# EAGLE schematic md (EAGLE 9.6.2)
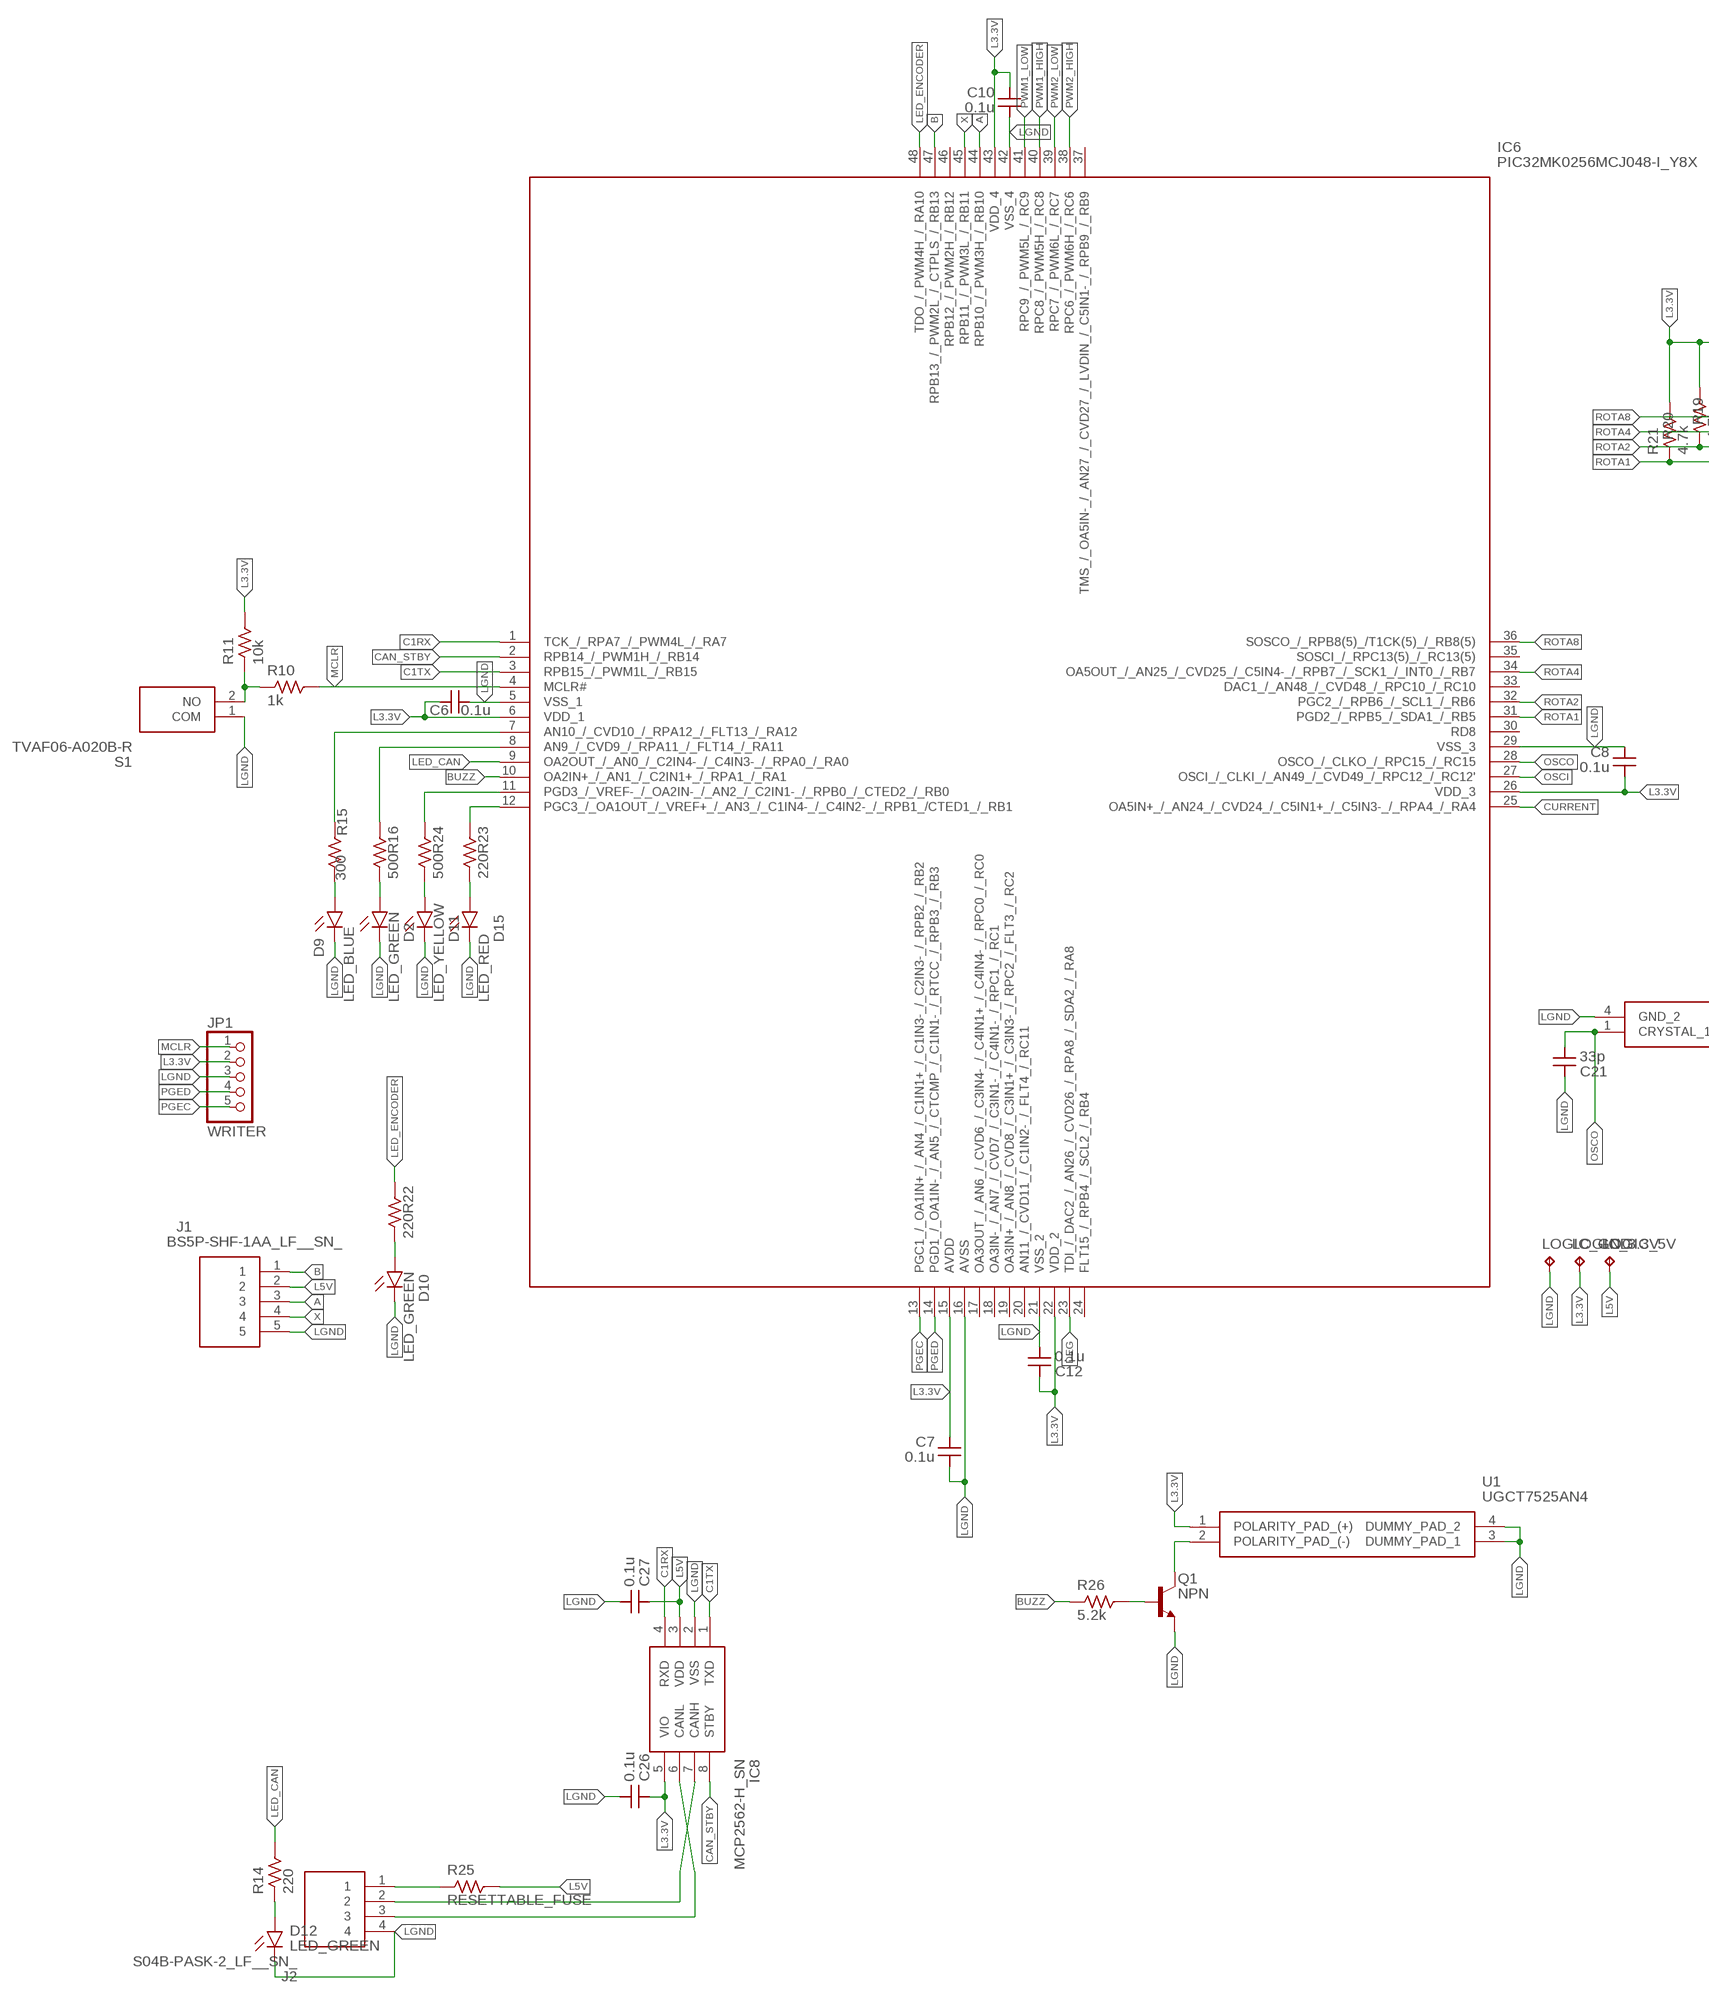
[diagram p0: schematic, sheet 1, part 1 of 2]
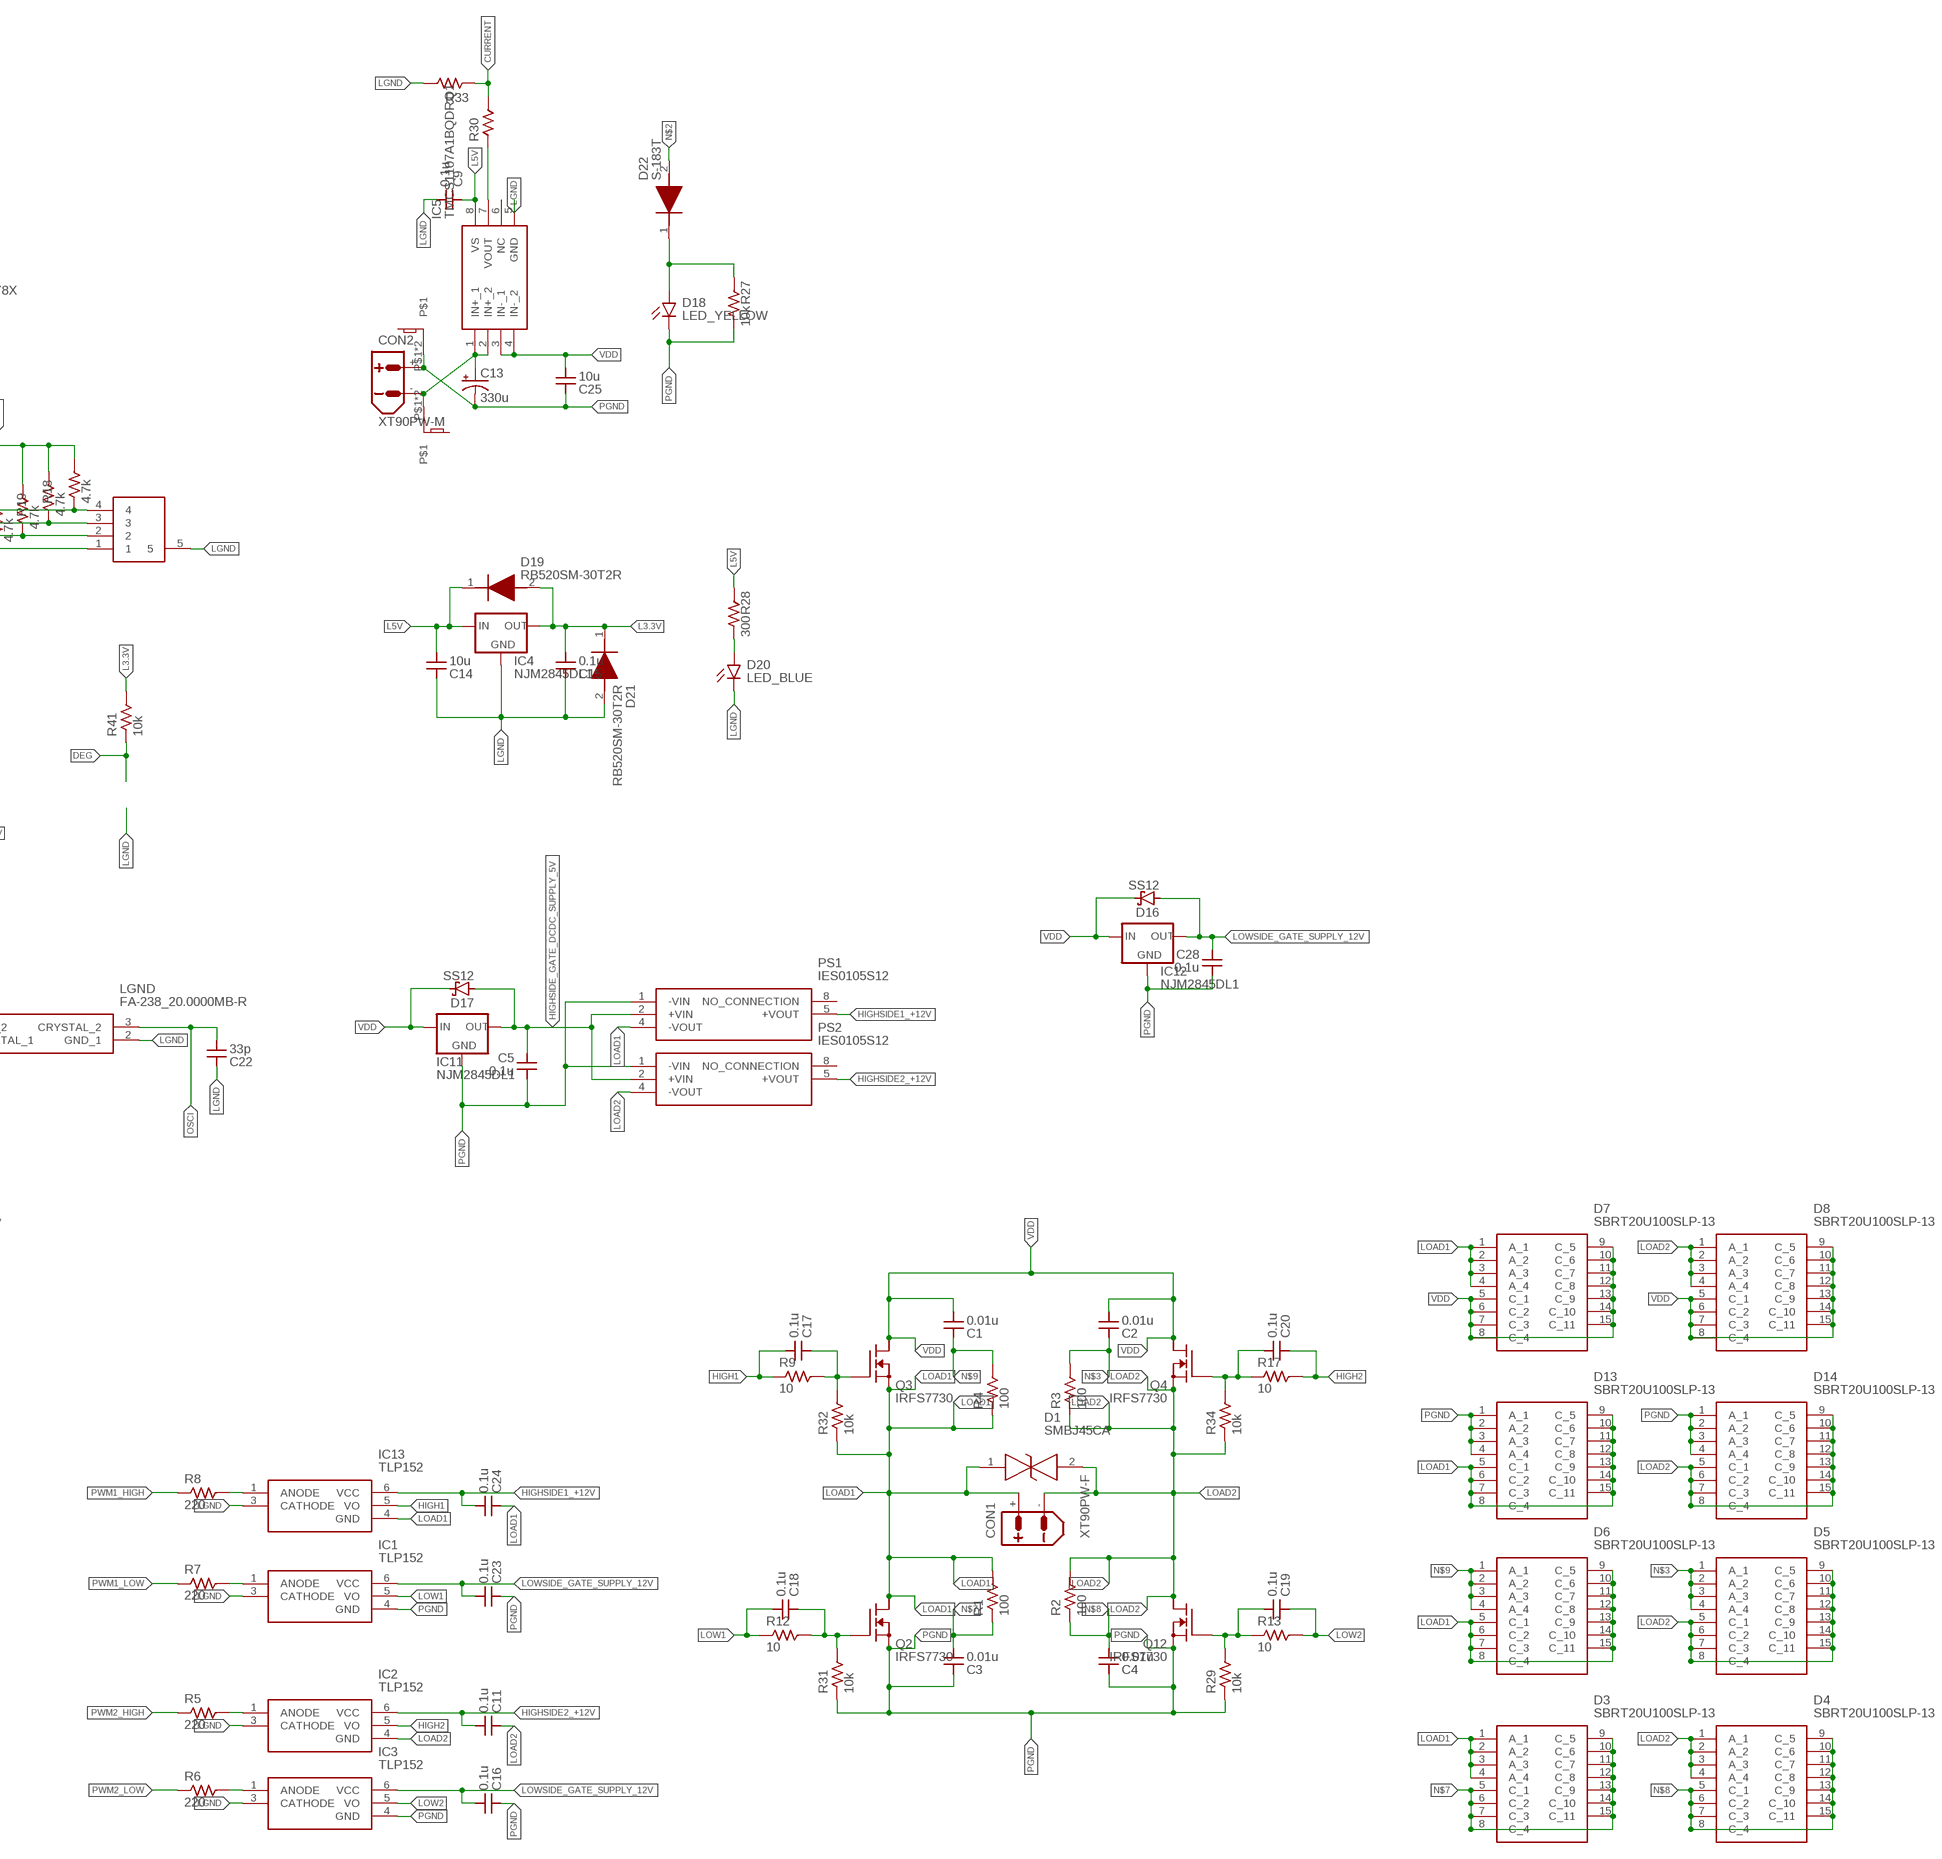
[diagram p1: schematic, sheet 1, part 2 of 2]

## Parts
C1  0.01u  CC3216  [C3216]
C2  0.01u  CC3216  [C3216]
C3  0.01u  CC3216  [C3216]
C4  0.01u  CC3216  [C3216]
C5  0.1u  CC1068  [C1608]
C6  0.1u  CC1068  [C1608]
C7  0.1u  CC1068  [C1608]
C8  0.1u  CC1068  [C1608]
C9  0.1u  CC1068  [C1608]
C10  0.1u  CC1068  [C1608]
C11  0.1u  CC1068  [C1608]
C12  0.1u  CC1068  [C1608]
C13  330u  C-POL-US_ECAP-8.5MM  [CAPAE830X1050N]
C14  10u  CC1068  [C1608]
C15  0.1u  CC1068  [C1608]
C16  0.1u  CC1068  [C1608]
C17  0.1u  CC1068  [C1608]
C18  0.1u  CC1068  [C1608]
C19  0.1u  CC1068  [C1608]
C20  0.1u  CC1068  [C1608]
C21  33p  CC1068  [C1608]
C22  33p  CC1068  [C1608]
C23  0.1u  CC1068  [C1608]
C24  0.1u  CC1068  [C1608]
C25  10u  CC3216  [C3216]
C26  0.1u  CC1068  [C1608]
C27  0.1u  CC1068  [C1608]
C28  0.1u  CC1068  [C1608]
CON1  XT90PW-F  [XT90PW-F]
CON2  XT90PW-M  [XT90PW-M]
D1  SMBJ45CA  [DIOM5336X265N]
D2  LED_GREEN  CHIP-FLAT-G_0603-0.55MM  [LEDC1608X55N_FLAT-G]
D3  SBRT20U100SLP-13  [SBRT20U100SLP13]
D4  SBRT20U100SLP-13  [SBRT20U100SLP13]
D5  SBRT20U100SLP-13  [SBRT20U100SLP13]
D6  SBRT20U100SLP-13  [SBRT20U100SLP13]
D7  SBRT20U100SLP-13  [SBRT20U100SLP13]
D8  SBRT20U100SLP-13  [SBRT20U100SLP13]
D9  LED_BLUE  CHIP-FLAT-B_0603-0.55MM  [LEDC1608X55N_FLAT-B]
D10  LED_GREEN  CHIP-FLAT-G_0603-0.55MM  [LEDC1608X55N_FLAT-G]
D11  LED_YELLOW  CHIP-FLAT-Y_0603-0.55MM  [LEDC1608X55N_FLAT-Y]
D12  LED_GREEN  CHIP-FLAT-G_0603-0.55MM  [LEDC1608X55N_FLAT-G]
D13  SBRT20U100SLP-13  [SBRT20U100SLP13]
D14  SBRT20U100SLP-13  [SBRT20U100SLP13]
D15  LED_RED  CHIP-FLAT-R_0603-0.55MM  [LEDC1608X55N_FLAT-R]
D16  SS12  [SMA]
D17  SS12  [SMA]
D18  LED_YELLOW  CHIP-FLAT-Y_0603-0.55MM  [LEDC1608X55N_FLAT-Y]
D19  RB520SM-30T2R  [DIOC1608X70N]
D20  LED_BLUE  CHIP-FLAT-B_0603-0.55MM  [LEDC1608X55N_FLAT-B]
D21  RB520SM-30T2R  [DIOC1608X70N]
D22  S-183T  [SODFL3516X70N]
IC1  TLP152  [11-4L1S(5-PIN-SOIC)]
IC2  TLP152  [11-4L1S(5-PIN-SOIC)]
IC3  TLP152  [11-4L1S(5-PIN-SOIC)]
IC4  NJM2845DL1  [TO252]
IC5  TMCS1107A1BQDRQ1  [SOIC127P600X175-8N]
IC6  PIC32MK0256MCJ048-I_Y8X  [QFP50P900X900X120-48N]
IC8  MCP2562-H_SN  [SOIC127P600X175-8N]
IC11  NJM2845DL1  [TO252]
IC12  NJM2845DL1  [TO252]
IC13  TLP152  [11-4L1S(5-PIN-SOIC)]
J1  BS5P-SHF-1AA_LF__SN_  [HDRRA5W64P0X250_1X5_1250X600X5]
J2  S04B-PASK-2_LF__SN_  [S04BPASK2LFSN]
JP1  WRITER  PINHD-1X5/90  [1X05/90]
LGND  FA-238_20.0000MB-R  [FA238200000MBR]
LOGIC_3.3V  TPPAD1-13  [P1-13]
LOGIC_5V  TPPAD1-13  [P1-13]
LOGIC_GND  TPPAD1-13  [P1-13]
PS1  IES0105S12  [IES0105S12]
PS2  IES0105S12  [IES0105S12]
Q1  NPN  NPN_SC59-BEC  [SC59]
Q2  IRFS7730  [D2PAK-7]
Q3  IRFS7730  [D2PAK-7]
Q4  IRFS7730  [D2PAK-7]
Q12  IRFS7730  [D2PAK-7]
R1  100  R2W  [C2512]
R2  100  R2W  [C2512]
R3  100  R2W  [C2512]
R4  100  R2W  [C2512]
R5  220  R1/10W  [C1608]
R6  220  R1/10W  [C1608]
R7  220  R1/10W  [C1608]
R8  220  R1/10W  [C1608]
R9  10  R3/4W  [2010]
R10  1k  R1/10W  [C1608]
R11  10k  R1/10W  [C1608]
R12  10  R3/4W  [2010]
R13  10  R3/4W  [2010]
R14  220  R1/10W  [C1608]
R15  300  R1/10W  [C1608]
R16  500  R1/10W  [C1608]
R17  10  R3/4W  [2010]
R18  4.7k  R1/10W  [C1608]
R19  4.7k  R1/10W  [C1608]
R20  4.7k  R1/10W  [C1608]
R21  4.7k  R1/10W  [C1608]
R22  220  R1/10W  [C1608]
R23  220  R1/10W  [C1608]
R24  500  R1/10W  [C1608]
R25  RESETTABLE_FUSE  R3216(1206)  [C3216]
R26  5.2k  R1/10W  [C1608]
R27  10k  R1/10W  [C1608]
R28  300  R1/10W  [C1608]
R29  10k  R1/10W  [C1608]
R30  R1/10W  [C1608]
R31  10k  R1/10W  [C1608]
R32  10k  R1/10W  [C1608]
R33  R1/10W  [C1608]
R34  10k  R1/10W  [C1608]
R41  10k  R1/10W  [C1608]
S1  TVAF06-A020B-R  [TVAF06A020BR]
S2  DRR4016  [DRR4016]
SCREW1  KIBANNNEZI  [ＰＣＢ－５４Ｌ（Ｍ３）]
SCREW2  KIBANNNEZI  [ＰＣＢ－５４Ｌ（Ｍ３）]
U1  UGCT7525AN4  [UGCT7525AN4]

## Nets
A: IC6.44(RPB10_/_PWM3H_/_RB10) J1.3
B: IC6.47(RPB13_/_PWM2L_/_CTPLS_/_RB13) J1.1
BUZZ: IC6.10(OA2IN+_/_AN1_/_C2IN1+_/_RPA1_/_RA1) R26.1
C1RX: IC6.1(TCK_/_RPA7_/_PWM4L_/_RA7) IC8.4(RXD)
C1TX: IC6.3(RPB15_/_PWM1L_/_RB15) IC8.1(TXD)
CAN_STBY: IC6.2(RPB14_/_PWM1H_/_RB14) IC8.8(STBY)
CURRENT: IC6.25(OA5IN+_/_AN24_/_CVD24_/_C5IN1+_/_C5IN3-_/_RPA4_/_RA4) R30.2 R33.1
DEG: IC6.23(TDI_/_DAC2_/_AN26_/_CVD26_/_RPA8_/_SDA2_/_RA8) R41.1
H1GATE: C17.2 Q3.G(Nｃｈ-G) R9.P$2 R32.2
H2GATE: C20.1 Q4.G(Nｃｈ-G) R17.P$1 R34.2
HIGH1: C17.1 IC13.5(VO) R9.P$1
HIGH2: C20.2 IC2.5(VO) R17.P$2
HIGHSIDE1_+12V: C24.1 IC13.6(VCC) PS1.5(+VOUT)
HIGHSIDE2_+12V: C11.1 IC2.6(VCC) PS2.5(+VOUT)
HIGHSIDE_GATE_DCDC_SUPPLY_5V: C5.2 D17.A IC11.3(OUT) PS1.2(+VIN) PS2.2(+VIN)
IN1: IC8.7(CANH) J2.2
IN2: IC8.6(CANL) J2.3
L1GATE: C18.2 Q2.G(Nｃｈ-G) R12.P$2 R31.2
L2GATE: C19.1 Q12.G(Nｃｈ-G) R13.P$1 R29.2
L3.3V: C6.2 C7.2 C8.1 C10.2 C12.2 C15.1 C26.2 D19.2(A) D21.1(K) IC4.3(OUT) IC6.6(VDD_1) IC6.15(AVDD) IC6.22(VDD_2) IC6.26(VDD_3) IC6.43(VDD_4) IC8.5(VIO) JP1.2 LOGIC_3.3V.TP R11.2 R18.2 R19.2 R20.2 R21.2 R41.2 U1.1(POLARITY_PAD_(+))
L5V: C9.2 C14.1 C27.2 D19.1(K) IC4.1(IN) IC5.8(VS) IC8.3(VDD) J1.2 LOGIC_5V.TP R25.2 R28.2
LED_CAN: IC6.9(OA2OUT_/_AN0_/_C2IN4-_/_C4IN3-_/_RPA0_/_RA0) R14.2
LED_ENCODER: IC6.48(TDO_/_PWM4H_/_RA10) R22.2
LGND: C6.1 C7.1 C8.2 C9.1 C10.1 C12.1 C14.2 C15.2 C21.2 C22.2 C26.1 C27.1 D2.C D9.C D10.C D11.C D12.C D15.C D20.C D21.2(A) IC1.3(CATHODE) IC2.3(CATHODE) IC3.3(CATHODE) IC4.2(GND) IC5.5(GND) IC6.5(VSS_1) IC6.16(AVSS) IC6.21(VSS_2) IC6.29(VSS_3) IC6.42(VSS_4) IC8.2(VSS) IC13.3(CATHODE) J1.5 J2.4 JP1.3 LGND.2(GND_1) LGND.4(GND_2) LOGIC_GND.TP Q1.E R33.2 S1.1(COM) S2.5 U1.3(DUMMY_PAD_1) U1.4(DUMMY_PAD_2)
LOAD1: C24.2 CON1.+ D1.1 D3.1(A_1) D3.2(A_2) D3.3(A_3) D3.4(A_4) D6.5(C_1) D6.6(C_2) D6.7(C_3) D6.8(C_4) D6.9(C_5) D6.10(C_6) D6.11(C_7) D6.12(C_8) D6.13(C_9) D6.14(C_10) D6.15(C_11) D7.1(A_1) D7.2(A_2) D7.3(A_3) D7.4(A_4) D13.5(C_1) D13.6(C_2) D13.7(C_3) D13.8(C_4) D13.9(C_5) D13.10(C_6) D13.11(C_7) D13.12(C_8) D13.13(C_9) D13.14(C_10) D13.15(C_11) IC13.4(GND) PS1.4(-VOUT) Q2.D(NｃｈD) Q3.S1(NｃｈS) Q3.S2(NｃｈS) Q3.S3(NｃｈS) Q3.S4(NｃｈS) Q3.S5(NｃｈS) R1.2 R4.1 R32.1
LOAD2: C11.2 CON1.- D1.2 D4.1(A_1) D4.2(A_2) D4.3(A_3) D4.4(A_4) D5.5(C_1) D5.6(C_2) D5.7(C_3) D5.8(C_4) D5.9(C_5) D5.10(C_6) D5.11(C_7) D5.12(C_8) D5.13(C_9) D5.14(C_10) D5.15(C_11) D8.1(A_1) D8.2(A_2) D8.3(A_3) D8.4(A_4) D14.5(C_1) D14.6(C_2) D14.7(C_3) D14.8(C_4) D14.9(C_5) D14.10(C_6) D14.11(C_7) D14.12(C_8) D14.13(C_9) D14.14(C_10) D14.15(C_11) IC2.4(GND) PS2.4(-VOUT) Q4.S1(NｃｈS) Q4.S2(NｃｈS) Q4.S3(NｃｈS) Q4.S4(NｃｈS) Q4.S5(NｃｈS) Q12.D(NｃｈD) R2.2 R3.1 R34.1
LOW1: C18.1 IC1.5(VO) R12.P$1
LOW2: C19.2 IC3.5(VO) R13.P$2
LOWSIDE_GATE_SUPPLY_12V: C16.1 C23.1 C28.2 D16.A IC1.6(VCC) IC3.6(VCC) IC12.3(OUT)
MCLR: IC6.4(MCLR#) JP1.1 R10.2
N$1: D10.A R22.1
N$2: C13.1(+) CON2.- D22.2(A) IC5.1(IN+_1) IC5.2(IN+_2) SCREW1.P$1 SCREW1.P$2
N$3: C2.2 D5.1(A_1) D5.2(A_2) D5.3(A_3) D5.4(A_4) R3.2
N$4: IC3.1(ANODE) R6.2
N$5: R10.1 R11.1 S1.2(NO)
N$6: IC6.7(AN10_/_CVD10_/_RPA12_/_FLT13_/_RA12) R15.2
N$7: C3.1 D3.5(C_1) D3.6(C_2) D3.7(C_3) D3.8(C_4) D3.9(C_5) D3.10(C_6) D3.11(C_7) D3.12(C_8) D3.13(C_9) D3.14(C_10) D3.15(C_11) R1.1
N$8: C4.1 D4.5(C_1) D4.6(C_2) D4.7(C_3) D4.8(C_4) D4.9(C_5) D4.10(C_6) D4.11(C_7) D4.12(C_8) D4.13(C_9) D4.14(C_10) D4.15(C_11) R2.1
N$9: C1.2 D6.1(A_1) D6.2(A_2) D6.3(A_3) D6.4(A_4) R4.2
N$10: IC6.8(AN9_/_CVD9_/_RPA11_/_FLT14_/_RA11) R16.2
N$11: D9.A R15.1
N$12: D2.A R16.1
N$13: IC6.11(PGD3_/_VREF-_/_OA2IN-_/_AN2_/_C2IN1-_/_RPB0_/_CTED2_/_RB0) R24.2
N$14: IC2.1(ANODE) R5.2
N$15: IC6.12(PGC3_/_OA1OUT_/_VREF+_/_AN3_/_C1IN4-_/_C4IN2-_/_RPB1_/CTED1_/_RB1) R23.2
N$16: D11.A R24.1
N$17: D15.A R23.1
N$18: J2.1 R25.1
N$19: D12.A R14.1
N$20: D18.A D22.1(K) R27.2
N$21: D20.A R28.1
N$22: IC5.7(VOUT) R30.1
N$25: Q1.C U1.2(POLARITY_PAD_(-))
N$26: Q1.B R26.2
N$28: IC1.1(ANODE) R7.2
N$29: IC13.1(ANODE) R8.2
OSCI: C22.1 IC6.27(OSCI_/_CLKI_/_AN49_/_CVD49_/_RPC12_/_RC12') LGND.3(CRYSTAL_2)
OSCO: C21.1 IC6.28(OSCO_/_CLKO_/_RPC15_/_RC15) LGND.1(CRYSTAL_1)
PGEC: IC6.13(PGC1_/_OA1IN+_/_AN4_/_C1IN1+_/_C1IN3-_/_C2IN3-_/_RPB2_/_RB2) JP1.5
PGED: IC6.14(PGD1_/_OA1IN-_/_AN5_/_CTCMP_/_C1IN1-_/_RTCC_/_RPB3_/_RB3) JP1.4
PGND: C3.2 C4.2 C5.1 C13.2(-) C16.2 C23.2 C25.2 C28.1 CON2.+ D13.1(A_1) D13.2(A_2) D13.3(A_3) D13.4(A_4) D14.1(A_1) D14.2(A_2) D14.3(A_3) D14.4(A_4) D18.C IC1.4(GND) IC3.4(GND) IC11.2(GND) IC12.2(GND) PS1.1(-VIN) PS2.1(-VIN) Q2.S1(NｃｈS) Q2.S2(NｃｈS) Q2.S3(NｃｈS) Q2.S4(NｃｈS) Q2.S5(NｃｈS) Q12.S1(NｃｈS) Q12.S2(NｃｈS) Q12.S3(NｃｈS) Q12.S4(NｃｈS) Q12.S5(NｃｈS) R27.1 R29.1 R31.1 SCREW2.P$1 SCREW2.P$2
PWM1_HIGH: IC6.40(RPC8_/_PWM5H_/_RC8) R8.1
PWM1_LOW: IC6.41(RPC9_/_PWM5L_/_RC9) R7.1
PWM2_HIGH: IC6.38(RPC6_/_PWM6H_/_RC6) R5.1
PWM2_LOW: IC6.39(RPC7_/_PWM6L_/_RC7) R6.1
ROTA1: IC6.31(PGD2_/_RPB5_/_SDA1_/_RB5) R21.1 S2.1
ROTA2: IC6.32(PGC2_/_RPB6_/_SCL1_/_RB6) R20.1 S2.2
ROTA4: IC6.34(OA5OUT_/_AN25_/_CVD25_/_C5IN4-_/_RPB7_/_SCK1_/_INT0_/_RB7) R19.1 S2.3
ROTA8: IC6.36(SOSCO_/_RPB8(5)_/T1CK(5)_/_RB8(5)) R18.1 S2.4
VDD: C1.1 C2.1 C25.1 D7.5(C_1) D7.6(C_2) D7.7(C_3) D7.8(C_4) D7.9(C_5) D7.10(C_6) D7.11(C_7) D7.12(C_8) D7.13(C_9) D7.14(C_10) D7.15(C_11) D8.5(C_1) D8.6(C_2) D8.7(C_3) D8.8(C_4) D8.9(C_5) D8.10(C_6) D8.11(C_7) D8.12(C_8) D8.13(C_9) D8.14(C_10) D8.15(C_11) D16.C D17.C IC5.3(IN-_1) IC5.4(IN-_2) IC11.1(IN) IC12.1(IN) Q3.D(NｃｈD) Q4.D(NｃｈD)
X: IC6.45(RPB11_/_PWM3L_/_RB11) J1.4
Unconnected: IC5.6(NC) IC6.17(OA3OUT_/_AN6_/_CVD6_/_C3IN4-_/_C4IN1+_/_C4IN4-_/_RPC0_/_RC0) IC6.18(OA3IN-_/_AN7_/_CVD7_/_C3IN1-_/_C4IN1-_/_RPC1_/_RC1) IC6.19(OA3IN+_/_AN8_/_CVD8_/_C3IN1+_/_C3IN3-_/_RPC2_/_FLT3_/_RC2) IC6.20(AN11_/_CVD11_/_C1IN2-_/_FLT4_/_RC11) IC6.24(FLT15_/_RPB4_/_SCL2_/_RB4) IC6.30(RD8) IC6.33(DAC1_/_AN48_/_CVD48_/_RPC10_/_RC10) IC6.35(SOSCI_/_RPC13(5)_/_RC13(5)) IC6.37(TMS_/_OA5IN-_/_AN27_/_CVD27_/_LVDIN_/_C5IN1-_/_RPB9_/_RB9) IC6.46(RPB12_/_PWM2H_/_RB12) PS1.8(NO_CONNECTION) PS2.8(NO_CONNECTION)

## Library data of the parts
C1-C12 C14-C28 = Robocon-RLC:CC: Ceramic Condensare
C13 = Capacitor:C-POL-US: Capacitor Polarised - ANSI; CATEGORY: Capacitor
CON1 CON2 = amass:XT90: AMASS XT90 connector Store in Japan AMASS XT90 connector <https://szc.jp/ams-xt90>
D1 = SMBJ45CA:SMBJ45CA: Diode TVS Single Bi-Dir 45V 600W 2-Pin SMB T/R Source: Datasheet <https://componentsearchengine.com/Datasheets/2/SMBJ45CA.pdf>; DESCRIPTION: Diode TVS Single Bi-Dir 45V 600W 2-Pin SMB T/R; HEIGHT: 2.65mm; MANUFACTURER_NAME: LITTELFUSE; MANUFACTURER_PART_NUMBER: SMBJ45CA; MOUSER_PART_NUMBER: 576-SMBJ45CA; MOUSER_PRICE-STOCK: https://www.mouser.co.uk/ProductDetail/Littelfuse/SMBJ45CA?qs=zHiv0nsVGmogK0%252BNWlgMuw%3D%3D
D2 D10 D12 = LED:CHIP-FLAT-G; CATEGORY: LED; COLOR: GREEN; DESCRIPTION: CHIP LED FLAT; SUB-CATEGORY: CHIP; TYPE: FLAT_TOP
D3-D8 D13 D14 = SBRT20U100SLP-13:SBRT20U100SLP-13: Schottky Diodes & Rectifiers 20A Trench SBR 100V 20A 0.70Vf 0.3mA Source: Datasheet <https://www.diodes.com/assets/Datasheets/SBRT20U100SLP.pdf>; DESCRIPTION: Schottky Diodes & Rectifiers 20A Trench SBR 100V 20A 0.70Vf 0.3mA; HEIGHT: 1.1mm; MANUFACTURER_NAME: Diodes Inc.; MANUFACTURER_PART_NUMBER: SBRT20U100SLP-13; MOUSER_PART_NUMBER: 621-SBRT20U100SLP-13; MOUSER_PRICE-STOCK: https://www.mouser.co.uk/ProductDetail/Diodes-Incorporated/SBRT20U100SLP-13?qs=JtunSoW0QGFe6euRj6s4hQ%3D%3D
D9 D20 = LED:CHIP-FLAT-B; CATEGORY: LED; COLOR: BLUE; DESCRIPTION: CHIP LED FLAT; SUB-CATEGORY: CHIP; TYPE: FLAT_TOP
D11 D18 = LED:CHIP-FLAT-Y; CATEGORY: LED; COLOR: YELLOW; DESCRIPTION: CHIP LED FLAT; SUB-CATEGORY: CHIP; TYPE: FLAT_TOP
D15 = LED:CHIP-FLAT-R; CATEGORY: LED; COLOR: RED; DESCRIPTION: CHIP LED FLAT; SUB-CATEGORY: CHIP; TYPE: FLAT_TOP
D16 D17 = Diodes:SS12: DIODE SCHOTTKY 20V 1A SMA Manufacturer's datasheet <https://www.onsemi.com/pub/Collateral/SS19-D.PDF>; CREATED_BY: PCBLayout.com; DIGIKEY_PART_NUMBER: SS12FSCT-ND; MANUFACTURER: ON Semiconductor; MPN: SS12; PACKAGE: SMA (DO-214AC)
D19 D21 = RB520SM-30T2R:RB520SM-30T2R: ROHM RB520SM-30T2R, SMT Schottky Diode, 30V 200mA, 2-Pin SOD-523 Source: Datasheet <https://componentsearchengine.com/Datasheets/1/RB520SM-30T2R.pdf>; DESCRIPTION: ROHM RB520SM-30T2R, SMT Schottky Diode, 30V 200mA, 2-Pin SOD-523; HEIGHT: 0.7mm; MANUFACTURER_NAME: ROHM Semiconductor; MANUFACTURER_PART_NUMBER: RB520SM-30T2R; MOUSER_PART_NUMBER: 755-RB520SM-30T2R; MOUSER_PRICE-STOCK: https://www.mouser.co.uk/ProductDetail/ROHM-Semiconductor/RB520SM-30T2R?qs=QcFhgjUTvvrFOzD9weskVg%3D%3D
D22 = S-183T:S-183T: SEMITEC S-183T Constant Current Diode, 20mA, 4.6V max, 2-Pin SMD Source: Datasheet <https://componentsearchengine.com/Datasheets/1/S-183T.pdf>; DESCRIPTION: SEMITEC S-183T Constant Current Diode, 20mA, 4.6V max, 2-Pin SMD; HEIGHT: 0.7mm; MANUFACTURER_NAME: Semitec; MANUFACTURER_PART_NUMBER: S-183T; MOUSER_PART_NUMBER: 954-S-183T; MOUSER_PRICE-STOCK: https://www.mouser.co.uk/ProductDetail/Semitec/S-183T?qs=wgO0AD0o1vuZ97qIyUGqmw%3D%3D
IC1-IC3 IC13 = TLP152:TLP152: Toshiba TLP152 DC Input IC Output Optocoupler, Surface Mount, 5-Pin SOIC Source: Datasheet <https://toshiba.semicon-storage.com/info/docget.jsp?did=13615&prodName=TLP152>; DESCRIPTION: Toshiba TLP152 DC Input IC Output Optocoupler, Surface Mount, 5-Pin SOIC; HEIGHT: mm; MANUFACTURER_NAME: Toshiba; MANUFACTURER_PART_NUMBER: TLP152
IC4 IC11 IC12 = Robocon-Regulator:NJM2845DL1
IC5 = Robocon-Sensor:TMCS1107A1BQDRQ1: Board Mount Current Sensors AEC-Q100, +/-420-V isolated Hall-effect current sensor with internal reference 8-SOIC -40 to 125 Source: Datasheet <https://www.ti.com/lit/ds/symlink/tmcs1107-q1.pdf?ts=1634009705469&ref_url=https%3A%2F%2Fwww.ti.com%2Fsitesearch%2Fdocs%2Funiversalsearch.tsp%3FlangPref%3Den-US%26searchTerm%3DTMCS1107A4UQDRQ1%26nr%3D2>; DESCRIPTION: Board Mount Current Sensors AEC-Q100, +/-420-V isolated Hall-effect current sensor with internal reference 8-SOIC -40 to 125; HEIGHT: 1.75mm; MANUFACTURER_NAME: Texas Instruments; MANUFACTURER_PART_NUMBER: TMCS1107A1BQDRQ1; MOUSER_PART_NUMBER: 595-TMCS1107A1BQDRQ1; MOUSER_PRICE-STOCK: https://www.mouser.co.uk/ProductDetail/Texas-Instruments/TMCS1107A1BQDRQ1?qs=A6eO%252BMLsxmRDGOpu2d0NVw%3D%3D
IC6 = PIC32MK0256MCJ048-I_Y8X:PIC32MK0256MCJ048-I_Y8X: 32-bit Microcontrollers - MCU PIC32MK, 256K Flash, Motor Control Features, CAN-FD, 48 Pin TQFP Source: Datasheet; DESCRIPTION: 32-bit Microcontrollers - MCU PIC32MK, 256K Flash, Motor Control Features, CAN-FD, 48 Pin TQFP; HEIGHT: 1.2mm; MANUFACTURER_NAME: Microchip; MANUFACTURER_PART_NUMBER: PIC32MK0256MCJ048-I/Y8X; MOUSER_PART_NUMBER: 579-0256MCJ048-I/Y8X; MOUSER_PRICE-STOCK: https://www.mouser.co.uk/ProductDetail/Microchip-Technology/PIC32MK0256MCJ048-I-Y8X?qs=vmHwEFxEFR8gYaXbO9BUkA%3D%3D
IC8 = MCP2562-H_SN:MCP2562-H_SN: CAN Interface IC CAN Tranceiver Source: Datasheet <https://componentsearchengine.com/Datasheets/1/MCP2562-H_SN.pdf>; DESCRIPTION: CAN Interface IC CAN Tranceiver; HEIGHT: 1.75mm; MANUFACTURER_NAME: Microchip; MANUFACTURER_PART_NUMBER: MCP2562-H/SN; MOUSER_PART_NUMBER: 579-MCP2562-H/SN; MOUSER_PRICE-STOCK: https://www.mouser.co.uk/ProductDetail/Microchip-Technology-Atmel/MCP2562-H-SN?qs=eTPcRhULBzyBgcQwH2ol9w%3D%3D
J1 = BS5P-SHF-1AA_LF__SN_:BS5P-SHF-1AA_LF__SN_: JST NH, 5 Way, 1 Row, Right Angle PCB Header Source: Datasheet <https://www.jst-mfg.com/product/pdf/eng/eNH.pdf>; DESCRIPTION: JST NH, 5 Way, 1 Row, Right Angle PCB Header; HEIGHT: 5.6mm; MANUFACTURER_NAME: JST (JAPAN SOLDERLESS TERMINALS); MANUFACTURER_PART_NUMBER: BS5P-SHF-1AA(LF)(SN); MOUSER_PART_NUMBER: N/A; MOUSER_PRICE-STOCK: https://www.mouser.co.uk/ProductDetail/JST/BS5P-SHF-1AALFSN/?qs=Cb2nCFKsA8o%252BiJBVSYMp9A%3D%3D
J2 = S04B-PASK-2_LF__SN_:S04B-PASK-2_LF__SN_: CONN HEADER R/A 4POS 2MM Source: Datasheet <https://www.jst-mfg.com/product/pdf/eng/ePA-F.pdf>; ARROW_PART_NUMBER: S04B-PASK-2(LF)(SN); ARROW_PRICE-STOCK: https://www.arrow.com/en/products/s04b-pask-2-lf-sn/jst-manufacturing; DESCRIPTION: CONN HEADER R/A 4POS 2MM; HEIGHT: 6.5mm; MANUFACTURER_NAME: JST (JAPAN SOLDERLESS TERMINALS); MANUFACTURER_PART_NUMBER: S04B-PASK-2(LF)(SN)
JP1 = Robocon-Pin_Header:PINHD-1X5: PIN HEADER
LGND = FA-238_20.0000MB-R:FA-238_20.0000MB-R: Crystals 20MHz 50PPM -20C +70C 15pF Source: Datasheet <https://componentsearchengine.com/Datasheets/1/FA-238 20.0000MB-R.pdf>; DESCRIPTION: Crystals 20MHz 50PPM -20C +70C 15pF; HEIGHT: 0.7mm; MANUFACTURER_NAME: Epson Timing; MANUFACTURER_PART_NUMBER: FA-238 20.0000MB-R; MOUSER_PART_NUMBER: 732-FA-23820B-R; MOUSER_PRICE-STOCK: https://www.mouser.co.uk/ProductDetail/Epson-Timing/FA-238-200000MB-R?qs=csoGsJbXmtBew1ok0N0Haw%3D%3D
LOGIC_3.3V LOGIC_5V LOGIC_GND = Robocon-Pin_Header:TP: Test pad
PS1 PS2 = IES0105S12:IES0105S12: Isolated DC/DC Converters DC-DC, 1W, Unregulated, SMD Source: Datasheet <https://componentsearchengine.com/Datasheets/2/IES0105S12.pdf>; DESCRIPTION: Isolated DC/DC Converters DC-DC, 1W, Unregulated, SMD; HEIGHT: 7.75mm; MANUFACTURER_NAME: XP POWER; MANUFACTURER_PART_NUMBER: IES0105S12; MOUSER_PART_NUMBER: 209-IES0105S12; MOUSER_PRICE-STOCK: https://www.mouser.co.uk/ProductDetail/XP-Power/IES0105S12?qs=Cb2nCFKsA8rFSc4uBRiKxQ%3D%3D
Q1 = Transistor:NPN: NPN - Generic; CATEGORY: Transistor; SUB-CATEGORY: BJT; TYPE: NPN
Q2-Q4 Q12 = Robocon-Transistor:IRFS7730
R1-R34 R41 = Robocon-RLC:R: Resistor
S1 = TVAF06-A020B-R:TVAF06-A020B-R: Vertical Flat Switch Source: Datasheet <https://akizukidenshi.com/download/ds/jianfu/tvaf06-a020b-r.pdf>; DESCRIPTION: Vertical Flat Switch; HEIGHT: 2.2mm; MANUFACTURER_NAME: Zhejiang Jianfu Electronics Co., Ltd; MANUFACTURER_PART_NUMBER: TVAF06-A020B-R
S2 = DRR4016:DRR4016: 16 Way Through Hole DIP Switch, Rotary Shaft Actuator Source: Datasheet; DESCRIPTION: 16 Way Through Hole DIP Switch, Rotary Shaft Actuator; HEIGHT: 10.5mm; MANUFACTURER_NAME: KNITTER-SWITCH; MANUFACTURER_PART_NUMBER: DRR4016
SCREW1 SCREW2 = nezikibann:KIBANNNEZI
U1 = UGCT7525AN4:UGCT7525AN4: SMD magnetic transducer Source: Datasheet <http://akizukidenshi.com/download/ds/universalelectronics/UGCT7525AN4.pdf>; DESCRIPTION: SMD magnetic transducer; HEIGHT: 2mm; MANUFACTURER_NAME: Universal; MANUFACTURER_PART_NUMBER: UGCT7525AN4